# Altium schematic sheet Sheet.SchDoc
size A3
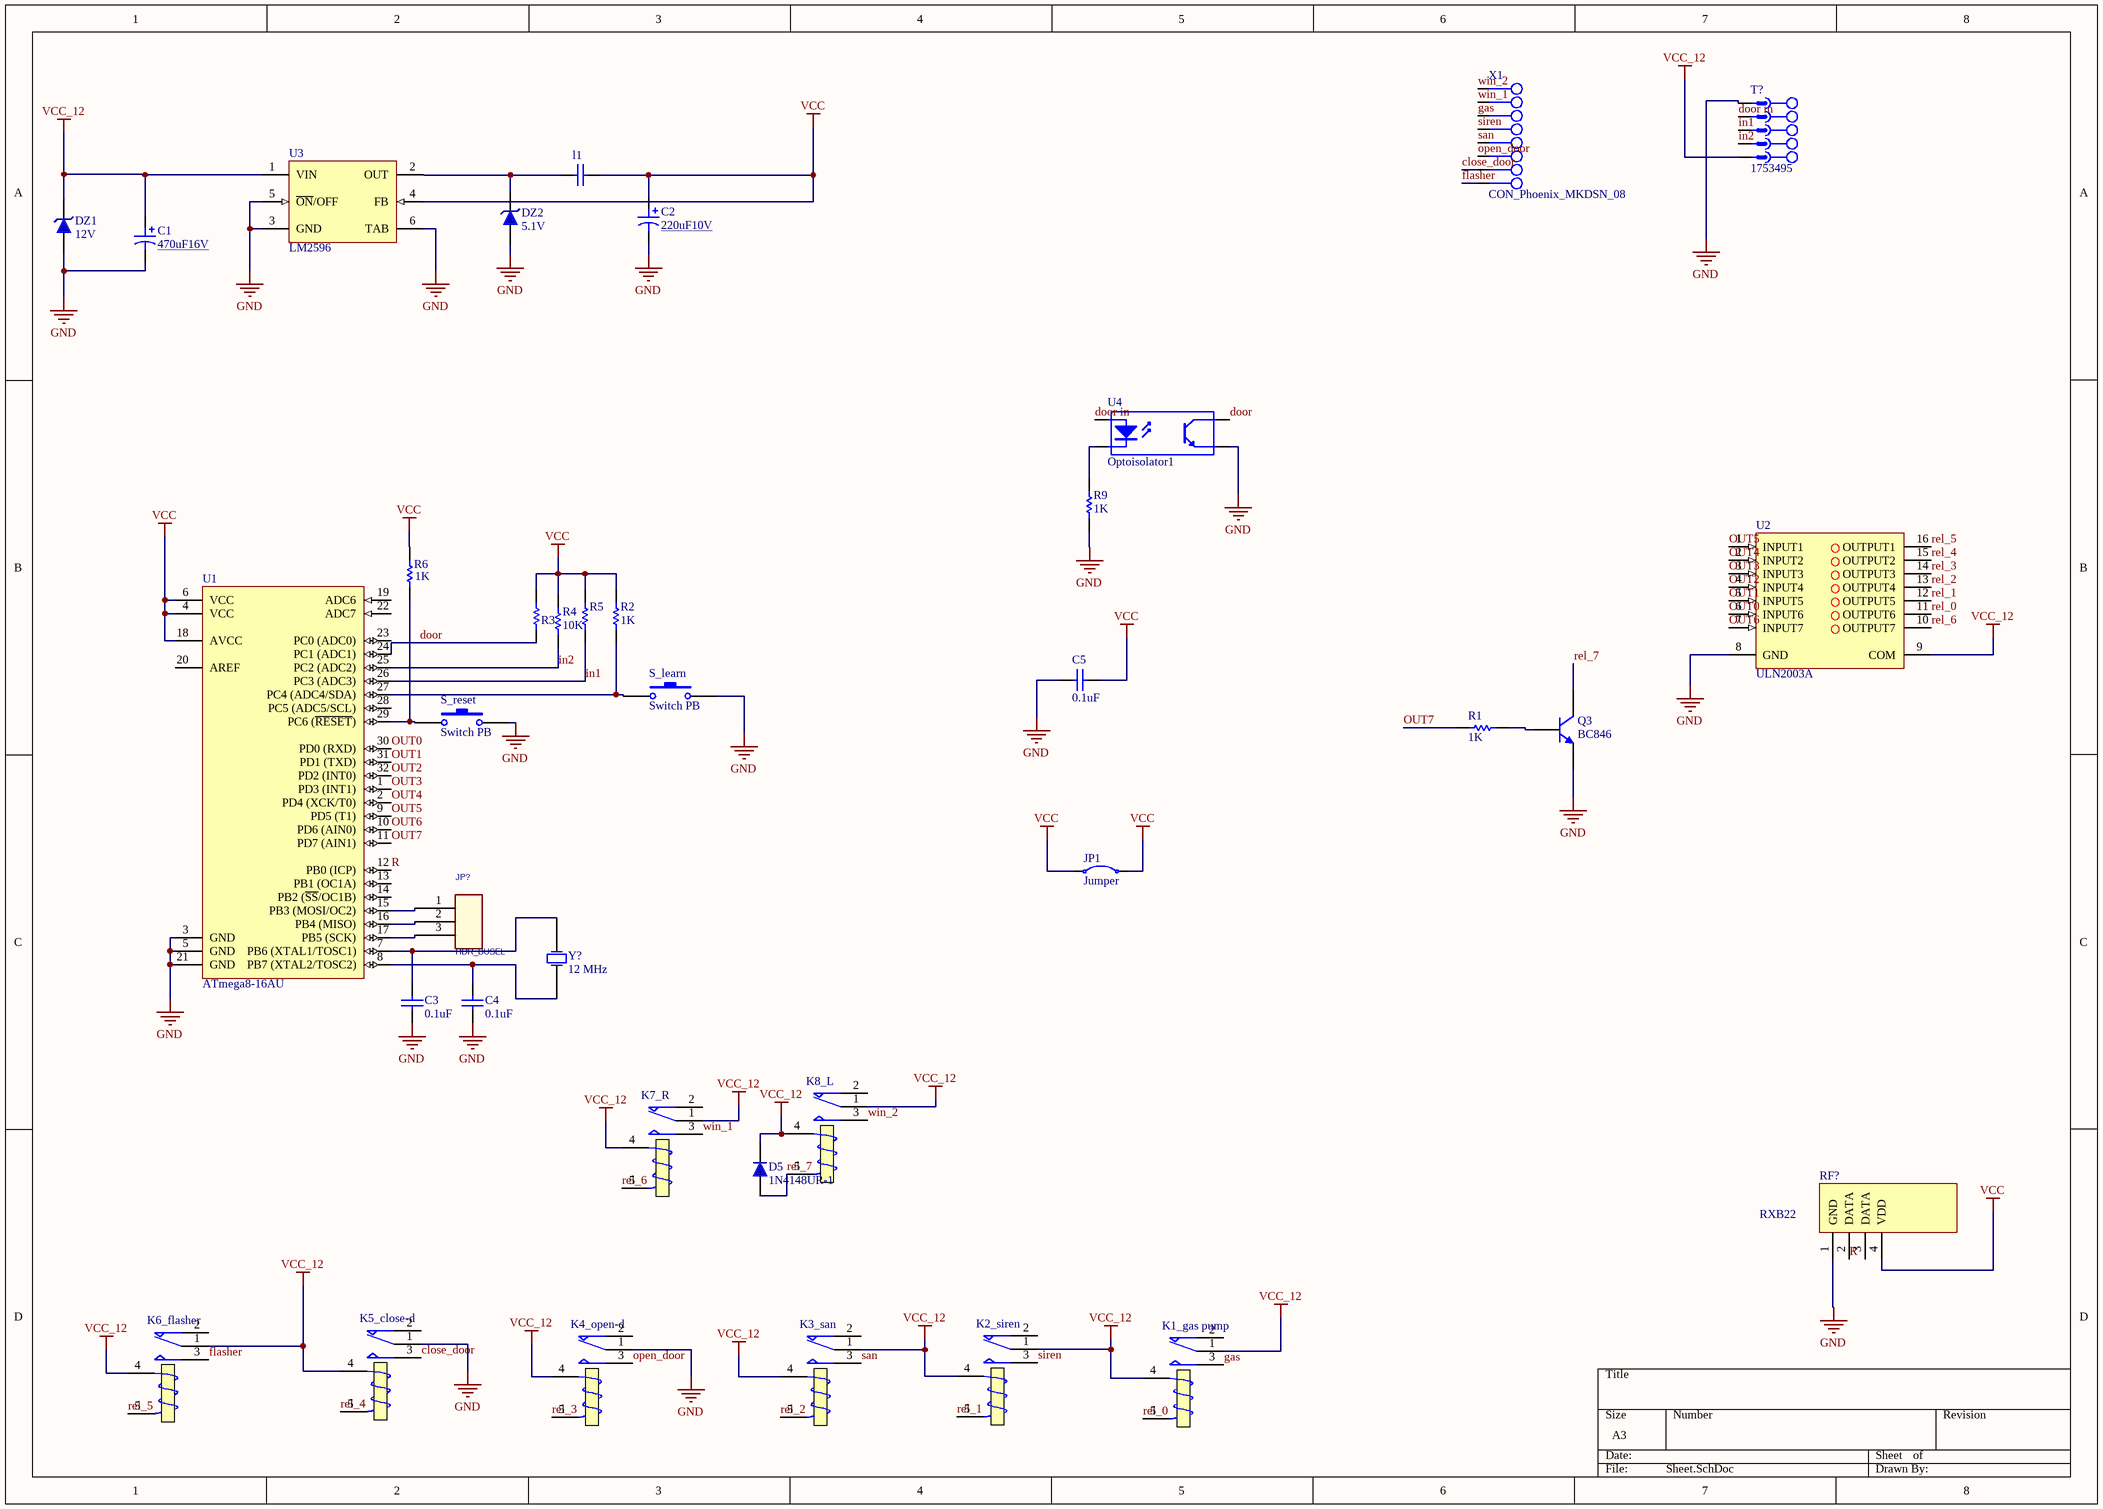
[diagram p0: Sheet.SchDoc]

## Parts
C1  470uF16V  [Cap electrolitic radial 8x12-3.5]
C2  220uF10V  [Cap electrolitic radial 8x12-3.5]
C3  0.1uF  [CAPC4817X12N]
C4  0.1uF  [CAPC4817X12N]
C5  0.1uF  [CAPC3413X12N]
D5  1N4148UR-1  [SOD80, LL-34]
DZ1  12V  [SOD80, LL-34]
DZ2  5.1V  [SOD80, LL-34]
JP1  Jumper  [J1016-400]
JP?  HDR_BUSEL  [HDR_1x3]
K1_gas_pump  (no value)  [Relay 18.85x15.35x15.70]
K2_siren  (no value)  [Relay 18.85x15.35x15.70]
K3_san  (no value)  [Relay 18.85x15.35x15.70]
K4_open-d  (no value)  [Relay 18.85x15.35x15.70]
K5_close-d  (no value)  [Relay 18.85x15.35x15.70]
K6_flasher  (no value)  [Relay 18.85x15.35x15.70]
K7_R  (no value)  [Relay 18.85x15.35x15.70]
K8_L  (no value)  [Relay 18.85x15.35x15.70]
l1  (no value)  [IND1206]
Q3  BC846  [SOT23_N]
R1  1K  [RESC4817X04N]
R2  1K  [RESC4817X04N]
R3  1K  [RESC4817X04N]  (value not drawn)
R4  10K  [RESC4817X04N]
R5  1K  [RESC4817X04N]  (value not drawn)
R6  1K  [RESC4817X04N]
R9  1K  [RESC4817X04N]
RF?  RXB22  [RXB22]
S_learn  Switch PB  [Switch - Push to On]
S_reset  Switch PB  [Switch - Push to On]
T?  1753495  [MSTBV 2,5/5-G-5]
U1  ATmega8-16AU  [32A_N]
U2  ULN2003A  [SO16_N]
U3  LM2596  [LM2596 5V SMD]
U4  Optoisolator1  [DIP-4]
X1  CON_Phoenix_MKDSN_08  [CON_MKDSN1,5/8-5,08]
Y?  12 MHz  [CRYSTAL Small]

## Nets
GND: C1.2 C2.2 C3.1 C4.1 C5.1 DZ1.1 DZ2.1 K4_open-d.1(COM) K5_close-d.1(COM) Q3.2(E) R9.2 RF?.1(GND) S_learn.2 S_reset.2 T?.1 U1.3(GND) U1.5(GND) U1.21(GND) U2.8(GND) U3.3(GND) U3.5(~{ON}/OFF) U3.6(TAB) U4.3(E)
VCC: C2.1 C5.2 JP1.1 JP1.2 l1.2 R2.2 R3.1 R4.2 R5.2 R6.2 RF?.4(VDD) U1.4(VCC) U1.6(VCC) U1.18(AVCC) U3.4(FB)
VCC_12: C1.1 D5.2 DZ1.2 K1_gas_pump.1(COM) K1_gas_pump.4(T1) K2_siren.1(COM) K2_siren.4(T1) K3_san.1(COM) K3_san.4(T1) K4_open-d.4(T1) K5_close-d.4(T1) K6_flasher.1(COM) K6_flasher.4(T1) K7_R.1(COM) K7_R.4(T1) K8_L.1(COM) K8_L.4(T1) T?.5 U2.9(COM) U3.1(VIN)
close_door: K5_close-d.3(NO) X1.7
door: R3.2 U1.24(PC1_(ADC1)) U4.4(C)
door in: T?.2 U4.1(A)
flasher: K6_flasher.3(NO) X1.8
gas: K1_gas_pump.3(NO) X1.3
in1: R5.1 T?.3 U1.26(PC3_(ADC3))
in2: R4.1 T?.4 U1.25(PC2_(ADC2))
open_door: K4_open-d.3(NO) X1.6
OUT0: U1.30(PD0_(RXD)) U2.6(INPUT6)
OUT1: U1.31(PD1_(TXD)) U2.5(INPUT5)
OUT2: U1.32(PD2_(INT0)) U2.4(INPUT4)
OUT3: U1.1(PD3_(INT1)) U2.3(INPUT3)
OUT4: U1.2(PD4_(XCK/T0)) U2.2(INPUT2)
OUT5: U1.9(PD5_(T1)) U2.1(INPUT1)
OUT6: U1.10(PD6_(AIN0)) U2.7(INPUT7)
OUT7: R1.1 U1.11(PD7_(AIN1))
R: RF?.2(DATA) U1.12(PB0_(ICP))
rel_0: K1_gas_pump.5(T2) U2.11(OUTPUT6)
rel_1: K2_siren.5(T2) U2.12(OUTPUT5)
rel_2: K3_san.5(T2) U2.13(OUTPUT4)
rel_3: K4_open-d.5(T2) U2.14(OUTPUT3)
rel_4: K5_close-d.5(T2) U2.15(OUTPUT2)
rel_5: K6_flasher.5(T2) U2.16(OUTPUT1)
rel_6: K7_R.5(T2) U2.10(OUTPUT7)
rel_7: D5.1 K8_L.5(T2) Q3.3(C)
san: K3_san.3(NO) X1.5
siren: K2_siren.3(NO) X1.4
win_1: K7_R.3(NO) X1.2
win_2: K8_L.3(NO) X1.1
NetC3_2: C3.2 U1.7(PB6_(XTAL1/TOSC1)) Y?.2(OSC2)
NetC4_2: C4.2 U1.8(PB7_(XTAL2/TOSC2)) Y?.1(OSC1)
NetDZ2_2: DZ2.2 l1.1 U3.2(OUT)
NetJP?_1: JP?.1 U1.15(PB3_(MOSI/OC2))
NetJP?_2: JP?.2 U1.16(PB4_(MISO))
NetJP?_3: JP?.3 U1.17(PB5_(SCK))
NetQ3_1: Q3.1(B) R1.2
NetR2_1: R2.1 S_learn.1 U1.27(PC4_(ADC4/SDA))
NetR6_1: R6.1 S_reset.1 U1.29(PC6_(~{RESET}))
NetR9_1: R9.1 U4.2(K)

Not connected (* = marked no-connect by the designer): K1_gas_pump 2(NC); K2_siren 2(NC); K3_san 2(NC); K4_open-d 2(NC); K5_close-d 2(NC); K6_flasher 2(NC); K7_R 2(NC); K8_L 2(NC); RF? 3(DATA); U1 13(PB1_(OC1A)) 14(PB2_(~{SS}/OC1B)) 19(ADC6) 20(AREF) 22(ADC7) 23(PC0_(ADC0)) 28(PC5_(ADC5/SCL))

## Library data of the parts
C1 C2 = Cap ELECTROLITIC TOTAL SIZE: Cap electrolitic radial; Designer: Abbas Basereh; Data: 16-12-2016; Part. No: *
  C1: VALUE: 470uF16V
  C2: VALUE: 220uF10V
C3 C4 = CAP SMD 1206: CAP 1206; Designer: Abbas Basereh; Desc.: CAP SMD 1206; Data: 16-12-2016
C5 = CAP SMD 0805: CAP 0805; Designer: Abbas Basereh; Desc.: CAP SMD 0805; Data: 16-12-2016
D5 = 1N4148UR-1: DIODE GEN PURP 75V 200MA DO213AA; Published: 2017-1-12; PackageVersion: 2017-1-12; PackageReference: DO-213AA&SOD-80; Publisher: Abbas Basereh; PackageDescription: DIODE GEN PURP 75V 200MA DO213AA; ComponentLink1Description: Manufacturer Link; ComponentLink1URL: http://www.digikey.com/product-detail/en/microsemi-corporation/1N4148UR-1/1N4148UR-1-ND/4377991; ComponentLink2Description: Datasheet; PART.NO: 1N4148UR-1
DZ1 DZ2 = ZENER GENERAL DIODE: DIODE ZENER GENERAL; Published: 2017-1-12; PackageVersion: 2017-1-12; PackageReference: DO 35; Publisher: Abbas Basereh; PackageDescription: DIODE GEN ZENER; ComponentLink1Description: Manufacturer Link; ComponentLink2Description: Datasheet
  DZ1: VALUE: 12V
  DZ2: VALUE: 5.1V
JP1 = JP: Jumper Component; Company: SJ Libraries; Designer: Eng. Saeid Jorablo; Category: Jumpers; ComponentLink1Description: Datasheet; ComponentLink2Description: Reference; HelpURL: http://s3.picofile.com/file/7443264187/Coming_Soon_logo.gif; Mounting Technology: Surface Mount\Through-Hole; Pin Count: 2; Publisher: SJ Unlimited; Status: Unreleased
JP? = Header 1x3: header or jumper box
K1_gas_pump K2_siren K3_san K4_open-d K5_close-d K6_flasher K7_R K8_L = Relay_SPDT: Single-Pole Dual-Throw Relay; Designer: Abbas Basereh; Mounting Technology: Through-Hole; ComponentLink1Description: Datasheet; Pin Count: 0; Update Date: 2017-3-1
l1 = INDUCTOR SMD PACKAGE: TOTAL INDUCTOR SMD PACK; Designer: Abbas Basereh; Desc.: INDUCTOR  SMD TOTAL PACKAGES; Data: 2017-3-10
Q3 = BC846: NPN General-purpose Transistor; Published: 2017-1-6; LatestRevisionDate: 12-Dec-2006; LatestRevisionNote: IPC-7351 Footprint Added.; DatasheetVersion: 4-Feb-2002; PackageVersion: 2017-1-6; PackageReference: SOT23; Publisher: Abbas Basereh; PackageDescription: 3-Pin SOT-23 Package 0.95 mm Pitch, 2.3 mm Lead Span; ComponentLink1Description: Manufacturer Link; ComponentLink1URL: http://www.semiconductors.philips.com/; ComponentLink2Description: Datasheet; ComponentLink2URL: http://www.semiconductors.philips.com/acrobat/datasheets/BC846_BC847_BC848_5.pdf
R1-R6 R9 = RES 1206 0.25W: RES 1206; Designer: Abbas Basereh; Desc.: RES SMD 1206; Data: 16-12-2016
S_learn S_reset = Switch PB: Push Button Switch
T? = CON_Phoenix_MSTBV_05: 5 Pitch: 5 mm Color: green Contact surface: Tin Assembly; Manufacturer: PHOENIX CONTACT; Connector type: PCB Terminal Block; designer: ABBAS BASEREH; Max Current: 12 A; Positions: 5; Voltage: 320 V; Category: Connector; ComponentLink1Description: Header, Nominal current: 12 A Rated voltage (III/2): 320 V Number of positions: 5 Pitch: 5 mm Color: green Contact surface: Tin Assembly: Soldering  DESIGNER:ABBAS BASEREH; ComponentLink2Description: Reference; Mounting Technology: Through-Hole; Pin Count: 5; Revision 1: 2017-3-1; Status: Unreleased; PART.NO: 1753495
U1 = ATmega8-16AU: 8-bit AVR Microcontroller, 4.5-5.5V, 16MHz, 8KB Flash, 512 Bytes EEPROM, 1KB SRAM, 32-pin TQFP, Industrial Grade (-40°C to 85°C); DatasheetVersion: revZ, Feb-2011; PackageVersion: revC, Oct-2010; PackageReference: 32A; PackageDescription: 32-Lead, 7x7x1.0 mm Body, 0.8mm Lead Pitch, Thin Profile Plastic Quad Flat Package (TQFP); Code_JEDEC: MS-026-ABA; ComponentLink1Description: Manufacturer URL; ComponentLink1URL: http://www.atmel.com/; ComponentLink2Description: ATmega8(L); ComponentLink2URL: http://www.atmel.com/dyn/resources/prod_documents/doc2486.pdf; ComponentLink3Description: ATmega8(L) Summary; ComponentLink3URL: http://www.atmel.com/dyn/resources/prod_documents/2486S.pdf
U2 = ULN2003A: SEVEN DARLINGTON ARRAYS; Published: 2017-3-2; DatasheetVersion: STMicroelectronics GROUP OF COMPANIES; PackageVersion: 2017-3-2; PackageReference: SO16_N; Publisher: Abbas Basereh; PackageDescription: 16-Pin Small Outline Integrated Circuit 1.27 mm Pitch, IPC High Density; Supplier 1: Digi-Key; Supplier Part Number 1: ULN2003A; Supplier 2: Mouser; Supplier Part Number 2: ULN2003A; ComponentLink1Description: Datasheet; ComponentLink2URL: http://www.st.com
U4 = Optoisolator1: 4-Pin Phototransistor Optocoupler; Published: 24-Mar-1999; LatestRevisionDate: 04-Mar-2005; LatestRevisionNote: Sch pins 3 & 4 Swapped.; DatasheetVersion: Nov-2003; PackageReference: DIP-4; Publisher: Altium Limited
X1 = CON_Phoenix_MKDSN_08: Manufacturer: PHOENIX CONTACT; Company: SJ Libraries; Connector type: PCB Terminal Block; designer: Eng. Saeid Jorablo; Max Current: 13.5 A; Positions: 8; Revision 1: 2012/10/1 : Adding Model; Voltage: 400 V; Category: Connector; ComponentLink1Description: Datasheet; ComponentLink2Description: Reference; HelpURL: http://s3.picofile.com/file/7443264187/Coming_Soon_logo.gif; Mounting Technology: Through-Hole; Pin Count: 8; Publisher: SJ UnLimited; Status: Unreleased; Update: 2012/10/1
Y? = XTAL_Crystal: XTAL Crystal; Designer: ABBAS BASEREH; Design Date: 2017-1-3; ComponentLink1Description: Datasheet; ComponentLink2Description: Reference; Mounting Technology: Surface Mount\Through-Hole; Value: 12 MHz; Status: Unreleased